# EAGLE design fallBz3 (EAGLE 7.4.0)
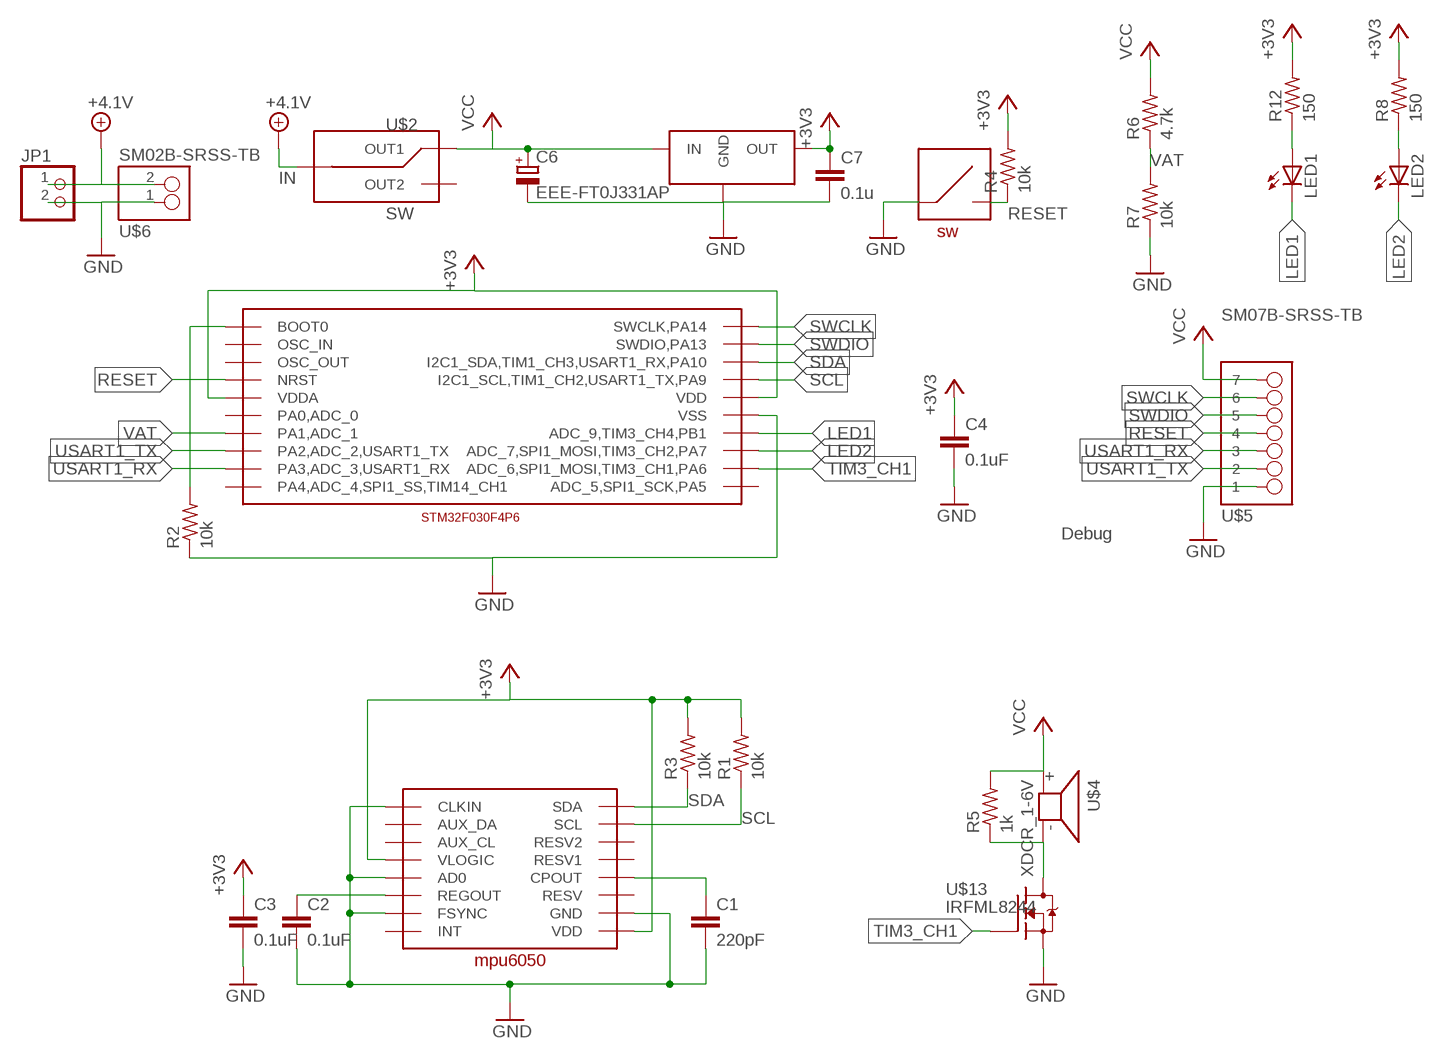
[diagram p0: schematic, sheet 1]

## Parts
C1  220pF  C-EUC0603K  [C0603K]
C2  0.1uF  C-EUC0603K  [C0603K]
C3  0.1uF  C-EUC0603K  [C0603K]
C4  0.1uF  C-EUC0603K  [C0603K]
C6  EEE-FT0J331AP  CPOL-EU153CLV-0605  [153CLV-0605]
C7  0.1u  C-EUC0603K  [C0603K]
JP1  PINHD-1X2  [1X02]
LED1  LEDCHIP-LED0603  [CHIP-LED0603]
LED2  LEDCHIP-LED0603  [CHIP-LED0603]
R1  10k  R-US_R0603  [R0603]
R2  10k  R-US_R0603  [R0603]
R3  10k  R-US_R0603  [R0603]
R4  10k  R-US_R0603  [R0603]
R5  1k  R-US_R0603  [R0603]
R6  4.7k  R-US_R0603  [R0603]
R7  10k  R-US_R0603  [R0603]
R8  150  R-US_R0603  [R0603]
R12  150  R-US_R0603  [R0603]
U$1  STM-TSSOP20  [STM-TSSOP20]
U$2  SW  [SS-12D00]
U$3  MPU6050  [MPU6050]
U$4  XDCR_1-6V  [XDCR_1-6V]
U$5  SM07B-SRSS-TB  [SM07B-SRSS-TB]
U$6  SM02B-SRSS-TB  [SM02B-SRSS-TB]
U$7  KMT071-NGJ-LHS  [KMT071-NGJ-LHS]
U$8  AP7361-33E  [SOT223]
U$13  IRFML8244  [SOT23]

## Nets
+3V3: C3.1 C4.1 C7.1 R1.2 R3.2 R4.2 R8.2 R12.2 U$1.P$5(VDDA) U$1.P$16(VDD) U$3.VDD U$3.VLOGIC U$8.OUT
+4.1V: JP1.1 U$2.IN U$6.2
GND: C1.2 C2.2 C3.2 C4.2 C6.- C7.2 JP1.2 R2.1 R7.1 U$1.P$15(VSS) U$3.AD0 U$3.CLKIN U$3.FSYNC U$3.GND U$5.P$1 U$6.1 U$7.SW0 U$7.SW00 U$8.GND1(GND) U$8.GND2(GND) U$13.2(S)
LED1: LED1.C U$1.P$14(ADC_9,TIM3_CH4,PB1)
LED2: LED2.C U$1.P$13(ADC_7,SPI1_MOSI,TIM3_CH2,PA7)
N$1: C2.1 U$3.REGOUT
N$2: LED2.A R8.1
N$3: R5.1 U$4.MINUS U$13.3(D)
N$5: C1.1 U$3.CPOUT
N$8: R2.2 U$1.P$1(BOOT0)
N$16: LED1.A R12.1
RESET: R4.1 U$1.P$4(NRST) U$5.P$4 U$7.SW1 U$7.SW11
SCL: R1.1 U$1.P$17(I2C1_SCL,TIM1_CH2,USART1_TX,PA9) U$3.SCL
SDA: R3.1 U$1.P$18(I2C1_SDA,TIM1_CH3,USART1_RX,PA10) U$3.SDA
SWCLK: U$1.P$20(SWCLK,PA14) U$5.P$6
SWDIO: U$1.P$19(SWDIO,PA13) U$5.P$5
TIM3_CH1: U$1.P$12(ADC_6,SPI1_MOSI,TIM3_CH1,PA6) U$13.1(G)
USART1_RX: U$1.P$9(PA3,ADC_3,USART1_RX) U$5.P$3
USART1_TX: U$1.P$8(PA2,ADC_2,USART1_TX) U$5.P$2
VAT: R6.1 R7.2 U$1.P$7(PA1,ADC_1)
VCC: C6.+ R5.2 R6.2 U$2.OUT1 U$4.PLUS U$5.P$7 U$8.IN
Unconnected: U$1.P$2(OSC_IN) U$1.P$3(OSC_OUT) U$1.P$6(PA0,ADC_0) U$1.P$10(PA4,ADC_4,SPI1_SS,TIM14_CH1) U$1.P$11(ADC_5,SPI1_SCK,PA5) U$2.OUT2 U$3.AUX_CL U$3.AUX_DA U$3.INT U$3.RESV U$3.RESV1 U$3.RESV2

## Notes on the sheet
- Debug

## Library data of the parts
C1-C4 C7 = resistor:C-EU: CAPACITOR, European symbol
C6 = rcl:CPOL-EU: POLARIZED CAPACITOR, European symbol
JP1 = pinhead:PINHD-1X2: PIN HEADER
LED1 LED2 = led:LED: LED OSRAM: - CHIPLED LG R971, LG N971, LY N971, LG Q971, LY Q971, LO R971, LY R971 LH N974, LH R974 LS Q976, LO Q976, LY Q976 LO Q996 - Hyper CHIPLED LW Q18S LB Q993, LB Q99A, LB R99A - SideLED LS A670, LO A670, LY A670, LG A670, LP A670 LB A673, LV A673, LT A673, LW A673 LH A674 LY A675 LS A676, LA A676, LO A676, LY A676, LW A676 LS A679, LY A679, LG A679 - Hyper Micro SIDELED® LS Y876, LA Y876, LO Y876, LY Y876 LT Y87S - SmartLED LW L88C, LW L88S LB L89C, LB L89S, LG L890 LS L89K, LO L89K, LY L89K LS L896, LA L896, LO L896, LY L896 - TOPLED LS T670, LO T670, LY T670, LG T670, LP T670 LSG T670, LSP T670, LSY T670, LOP T670, LYG T670 LG T671, LOG T671, LSG T671 LB T673, LV T673, LT T673, LW T673 LH T674 LS T676, LA T676, LO T676, LY T676, LB T676, LH T676, LSB T676, LW T676 LB T67C, LV T67C, LT T67C, LS T67K, LO T67K, LY T67K, LW E67C LS E67B, LA E67B, LO E67B, LY E67B, LB E67C, LV E67C, LT E67C LW T67C LS T679, LY T679, LG T679 LS T770, LO T770, LY T770, LG T770, LP T770 LB T773, LV T773, LT T773, LW T773 LH T774 LS E675, LA E675, LY E675, LS T675 LS T776, LA T776, LO T776, LY T776, LB T776 LHGB T686 LT T68C, LB T68C - Hyper Mini TOPLED® LB M676 - Mini TOPLED Santana® LG M470 LS M47K, LO M47K, LY M47K Source: http://www.osram.convergy.de LUXEON: - LUMILED® LXK2-PW12-R00, LXK2-PW12-S00, LXK2-PW14-U00, LXK2-PW14-V00 LXK2-PM12-R00, LXK2-PM12-S00, LXK2-PM14-U00 LXK2-PE12-Q00, LXK2-PE12-R00, LXK2-PE12-S00, LXK2-PE14-T00, LXK2-PE14-U00 LXK2-PB12-K00, LXK2-PB12-L00, LXK2-PB12-M00, LXK2-PB14-N00, LXK2-PB14-P00, LXK2-PB14-Q00 LXK2-PR12-L00, LXK2-PR12-M00, LXK2-PR14-Q00, LXK2-PR14-R00 LXK2-PD12-Q00, LXK2-PD12-R00, LXK2-PD12-S00 LXK2-PH12-R00, LXK2-PH12-S00 LXK2-PL12-P00, LXK2-PL12-Q00, LXK2-PL12-R00 Source: www.luxeon.com KINGBRIGHT: KA-3528ASYC Source: www.kingbright.com
R1-R8 R12 = resistor:R-US_: RESISTOR, American symbol
U$1 = STM-tssop20:STM-TSSOP20
U$2 = SW:SW
U$3 = MPU6050:MPU6050
U$4 = buzzer:XDCR_1-6V
U$5 = con-jst-sh:SM07B-SRSS-TB
U$6 = con-jst-sh:SM02B-SRSS-TB
U$7 = KMT071-NGJ-LHS:KMT071-NGJ-LHS
U$8 = AP7361-33E:AP7361-33E
U$13 = transistor-fet:IRFML8244

## Board
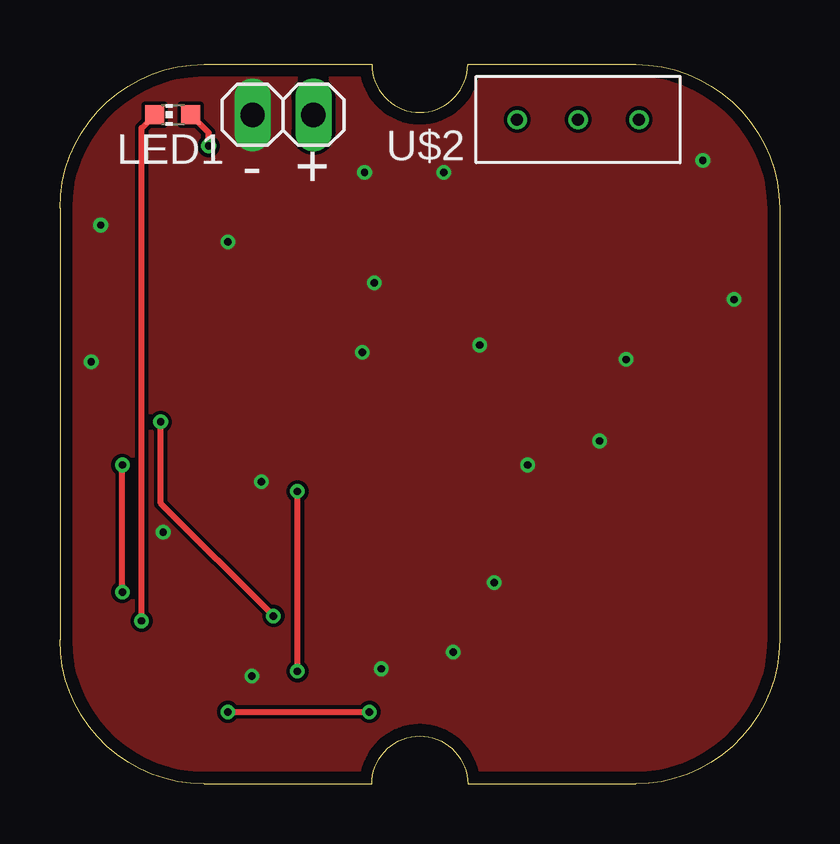
[diagram p1: board, top side]
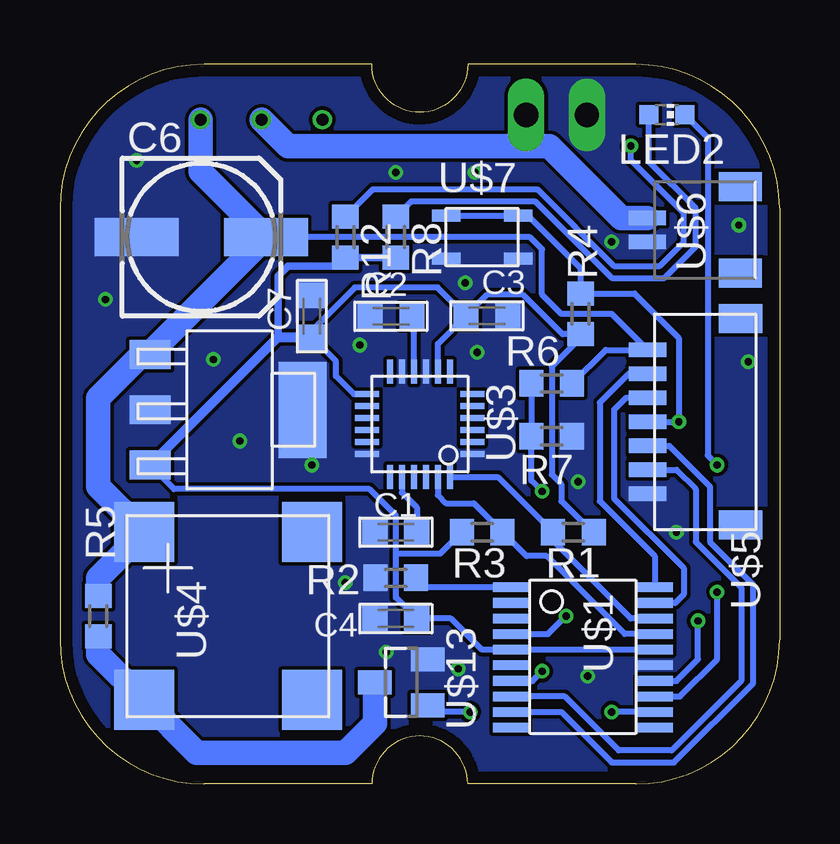
[diagram p2: board, bottom side, seen from below]

Size 30 x 30 mm. Coordinates in mm from the lower left corner, seen from the top.
Outline: 24,30 arc-90 30,24 30,6 arc-90 24,0 17,0 arc90 15,2 arc90 13,0 6,0 arc-90 0,6 0,24 arc-90 6,30 13,30 arc90 15,28 arc90 17,30 24,30
Copper layers (1*16): Top 0.035mm / dielectric 1.6mm / Bottom 0.035mm
Design rules "Elecrow_2-layer_PCB_eagle_rule": minimum track width 6mil, minimum drill 12mil, track to track 6mil, track to pad 6mil, pad to pad 6mil, via to via 8mil, smd to smd 0mil, copper to edge 20mil, drill to drill 10mil, minimum pad ring 6mil, minimum via ring 6mil, stop-mask expansion 0mil, vias tented up to drill 100mil, thermal gap 10mil

### Footprints (pad centres in the part's own frame; a part is rotated, then mirrored left to right if it is on the bottom)
C0603K = smd 1.05 x 1.08: 1 -0.875,0; 2 0.875,0
153CLV-0605 = smd 3.5 x 1.6: + 2.7,0; - -2.7,0
1X02 = drill 1.016 long: 1 -1.27,0; 2 1.27,0
CHIP-LED0603 = smd 0.8 x 0.8: A 0,-0.75; C 0,0.75
R0603 = smd 1 x 1.1: 1 -0.85,0; 2 0.85,0
STM-TSSOP20 = smd 0.4 x 1.5: P$1 -2.8,-3; P$2 -2.15,-3; P$3 -1.5,-3; P$4 -0.85,-3; P$5 -0.2,-3; P$6 0.45,-3; P$7 1.1,-3; P$8 1.75,-3; P$9 2.4,-3; P$10 3.05,-3; P$11 3.05,3; P$12 2.4,3; P$13 1.75,3; P$14 1.1,3; P$15 0.45,3; P$16 -0.2,3; P$17 -0.85,3; P$18 -1.5,3; P$19 -2.15,3; P$20 -2.8,3
SS-12D00 = drill 0.5: IN 0,0; OUT1 -2.54,0; OUT2 2.54,0
MPU6050 = smd 0.25 x 1: AD0 -0.25,-2.2; AUX_CL -1.25,-2.2; CPOUT 0.75,2.2; FSYNC 0.75,-2.2; INT 1.25,-2.2; REGOUT 0.25,-2.2; RESV 1.25,2.2; RESV1 0.25,2.2; RESV2 -0.25,2.2; SCL -0.75,2.2; SDA -1.25,2.2; VLOGIC -0.75,-2.2 | smd 1 x 0.25: AUX_DA -2.2,-1.25; CLKIN -2.2,1.25; GND 2.2,1.25; P$2 -2.2,0.75; P$3 -2.2,0.25; P$4 -2.2,-0.25; P$5 -2.2,-0.75; P$14 2.2,-0.75; P$15 2.2,-0.25; P$16 2.2,0.25; P$17 2.2,0.75; VDD 2.2,-1.25
XDCR_1-6V = smd 2.5 x 2.5: MINUS 3.5,3.5; P$1 -3.5,3.5; P$2 -3.5,-3.5; PLUS 3.5,-3.5
SM07B-SRSS-TB = smd 0.6 x 1.55: P$1 -3,0; P$2 -2,0; P$3 -1,0; P$4 0,0; P$5 1,0; P$6 2,0; P$7 3,0 | smd 1.2 x 1.8: P$8 -4.3,-3.875; P$9 4.3,-3.875
SM02B-SRSS-TB = smd 0.6 x 1.55: 1 -0.5,3.81; 2 0.5,3.81 | smd 1.2 x 1.8: P-MOUNT1 -1.8,-0.065; P-MOUNT2 1.8,-0.065
KMT071-NGJ-LHS = smd 1.2 x 0.5: SW0 -1.5,0.9; SW00 1.5,0.9; SW1 1.5,-0.9; SW11 -1.5,-0.9
SOT223 = smd 4 x 2: GND1 0,3.81 | smd 1.2 x 1.7: GND2 0,-2.54; IN -2.3,-2.54; OUT 2.3,-2.54
SOT23 = smd 1 x 1.4: 1 -0.95,-1.1; 2 0.95,-1.1; 3 0,1.1

### Placement (x,y rotation side)
C1  16,10.5 180 bottom
C2  16.2,19.5 180 bottom
C3  12.2,19.52 0 bottom
C4  16,6.9 180 bottom
C6  24.1,22.8 0 bottom
C7  19.5,19.5 90 bottom
JP1  9.3,27.9 180 top
LED1  4.7,27.9 90 top
LED2  4.7,27.9 270 bottom
R1  12.4,10.5 180 bottom
R2  16,8.6 0 bottom
R3  8.6,10.5 0 bottom
R4  8.3,19.6 270 bottom
R5  28.4,7 90 bottom
R6  9.5,16.7 0 bottom
R7  9.5,14.5 180 bottom
R8  16,22.8 270 bottom
R12  18.1,22.8 270 bottom
U$1  8.2,5.4 270 bottom
U$2  21.6,27.7 180 top
U$3  15,15 180 bottom
U$4  23,7 180 bottom
U$5  5.5,15.1 90 bottom
U$6  1.7,23.1 90 bottom
U$7  12.4,22.8 180 bottom
U$8  23.7,15.6 270 bottom
U$13  15.77,4.24 90 bottom

### Tracks (layer width: path | path; a pad name or v marks a point on that pad's centre or on a via)
+3V3
  Bottom 0.254: U$1.P$16 U$1.P$5 12.4,5.6 13.7,6.9 C4.1 16,7.78 16,9.6 | C3.1 14.26,20.7 17.7,20.7 19.5,18.9 C7.1 18.5,17.62 18.5,17 17.75,16.25 U$3.VDD | U$3.VLOGIC 14.25,18.34 C3.1 | 16,9.6 16,11.2 17.1,12.3 25.24,12.3 U$8.OUT | R1.2 14.15,9.6 16,9.6 | C3.1 12.2,20.4 10.7,20.4 9.05,18.75 R4.2 8.3,18.6 9.5,17.4 9.5,12.9 9.1,12.5 9.1,11.8 7.8,10.5 R3.2
  Bottom 0.305: R8.2 R12.2 18.45,21.6 20.5,21.6 20.91,21.18 20.91,18.62
  Bottom 0.406: U$8.OUT 20.91,18.62 C7.1
+4.1V
  Bottom 1.016: U$2.IN 20.5,26.6 10.5,26.6 | 10.5,26.6 9.6,26.6 6.6,23.6 U$6.2 | JP1.1 10.57,26.67 10.5,26.6
GND  (via drill 0.3)
  other vias: 26.8,26 1.7,23.3 12.6,18 8.4,12.6 17.5,18.3 13.1,20.9 23.6,17.7 22.5,14.3 19.5,13.3 18.1,8.4 13.4,4.8 8,4.5 28.1,20.2 4.3,10.5 1.3,17.6 16.4,5.5 7,22.6 12.7,25.5 16,25.5
  pour Bottom (rank 6, no thermals): 0,33 33,33 33,0 0,0
  pour Top (rank 6, no thermals): 0.5,29.5 32.2,29.5 32.2,-0.6 0.5,-0.6
LED1  (via drill 0.3)
  Top 0.254: v3.4,6.8 3.4,27.35 LED1.C
  Bottom 0.254: U$1.P$14 4.3,4.3 3.4,5.2 v3.4,6.8
LED2  (via drill 0.3)
  Top 0.254: v2.6,8 v2.6,13.3
  Bottom 0.254: LED2.C 3,26.95 3,13.7 v2.6,13.3 | U$1.P$13 4.15,3.65 2.6,5.2 v2.6,8
N$1
  Bottom 0.254: U$3.REGOUT 15.25,19.43 C2.1
N$2
  Bottom 0.254: R8.1 15.35,24.3 10.2,24.3 7,21.1 4.8,21.1 3.5,22.4 3.5,24 5.45,25.95 LED2.A
N$3
  Bottom 1.016: U$13.3 16.87,2.53 18.1,1.3 24.3,1.3 U$4.MINUS 28.4,5.4 R5.1
N$5
  Bottom 0.254: U$3.CPOUT 15.75,12.15 15.12,11.53 C1.1
N$8
  Bottom 0.254: U$1.P$1 14.75,8.2 R2.2
N$16  (via drill 0.3)
  Top 0.254: v6.2,26.6 6.2,27.15 LED1.A
  Bottom 0.254: R12.1 16.95,24.8 10.1,24.8 6.9,21.6 5,21.6 4,22.6 4,23.8 6.2,26 v6.2,26.6
RESET  (via drill 0.3)
  Top 0.254: v8.9,7 4.2,11.7 v4.2,15.1
  Bottom 0.254: U$1.P$4 9.65,6.25 v8.9,7 | U$7.SW1 U$7.SW11 10.5,23.7 8.3,21.5 R4.1 6.05,20.45 4.2,18.6 v4.2,15.1 U$5.P$4
SCL
  Bottom 0.254: U$3.SCL 14.25,12.05 13.9,11.7 12.75,11.7 R1.1 10.55,9.5 9.7,9.5 6.45,6.25 U$1.P$17
SDA
  Bottom 0.254: U$3.SDA 11.75,12.8 R3.1 9.45,10.15 6.2,6.9 U$1.P$18
SWCLK
  Bottom 0.254: U$5.P$6 6.3,17.1 7.5,15.9 7.5,11.8 5.2,9.5 U$1.P$20
SWDIO
  Bottom 0.254: U$5.P$5 6.4,16.1 6.9,15.6 6.9,11.9 4,9 4,7.9 4.35,7.55 U$1.P$19
TIM3_CH1  (via drill 0.3)
  Top 0.254: v7,3 v12.9,3
  Bottom 0.254: U$1.P$12 v7,3 | v12.9,3 14.38,3 U$13.1
USART1_RX
  Bottom 0.254: U$5.P$3 4.6,14.1 2.9,12.4 2.9,10.1 1.1,8.3 1.1,4.2 4.4,0.9 7,0.9 9.1,3 U$1.P$9
USART1_TX
  Bottom 0.254: U$5.P$2 4.3,13.1 3.5,12.3 3.5,10.1 1.6,8.2 1.6,4.3 4.5,1.4 6.7,1.4 8.95,3.65 U$1.P$8
VAT  (via drill 0.3)
  Top 0.254: v9.9,4.7 v9.9,12.2
  Bottom 0.254: U$1.P$7 10.3,4.3 v9.9,4.7 | v9.9,12.2 10.35,12.65 R7.2 R6.1
VCC
  Bottom 0.254: C6.+ 10.4,22.8 9.9,22.3 9.9,20.4 9.1,19.6 7,19.6 U$5.P$7 7.25,18.1 R6.2
  Bottom 1.016: U$2.OUT1 24.14,25.54 C6.+ 26.24,17.96 U$8.IN 26.6,17.9 28.4,16.1 28.4,12.4 U$4.PLUS 28.4,8.6 R5.2

### Text on the board
tNames: - +